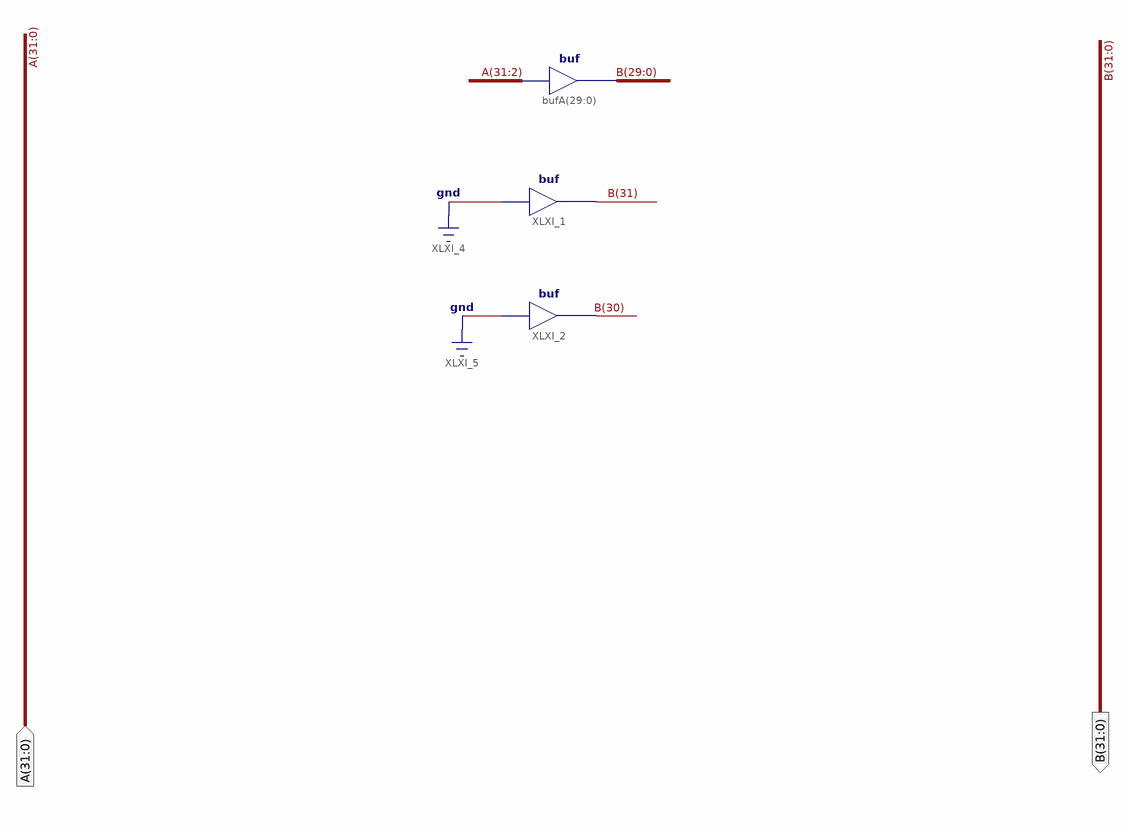
[diagram p0: schematic sheet 1]
// Xilinx ISE schematic right_shift2.sch (artix7) as structural Verilog: 3 symbols, 2 ports
module right_shift2 (
  input  [31:0] A,
  output [31:0] B
);

  buf XLXI_1 (B[31], 1'b0);
  buf XLXI_2 (B[30], 1'b0);
  assign B[29:0] = A[31:2];  // buf bufA[29..0], 30 bits wide
endmodule
